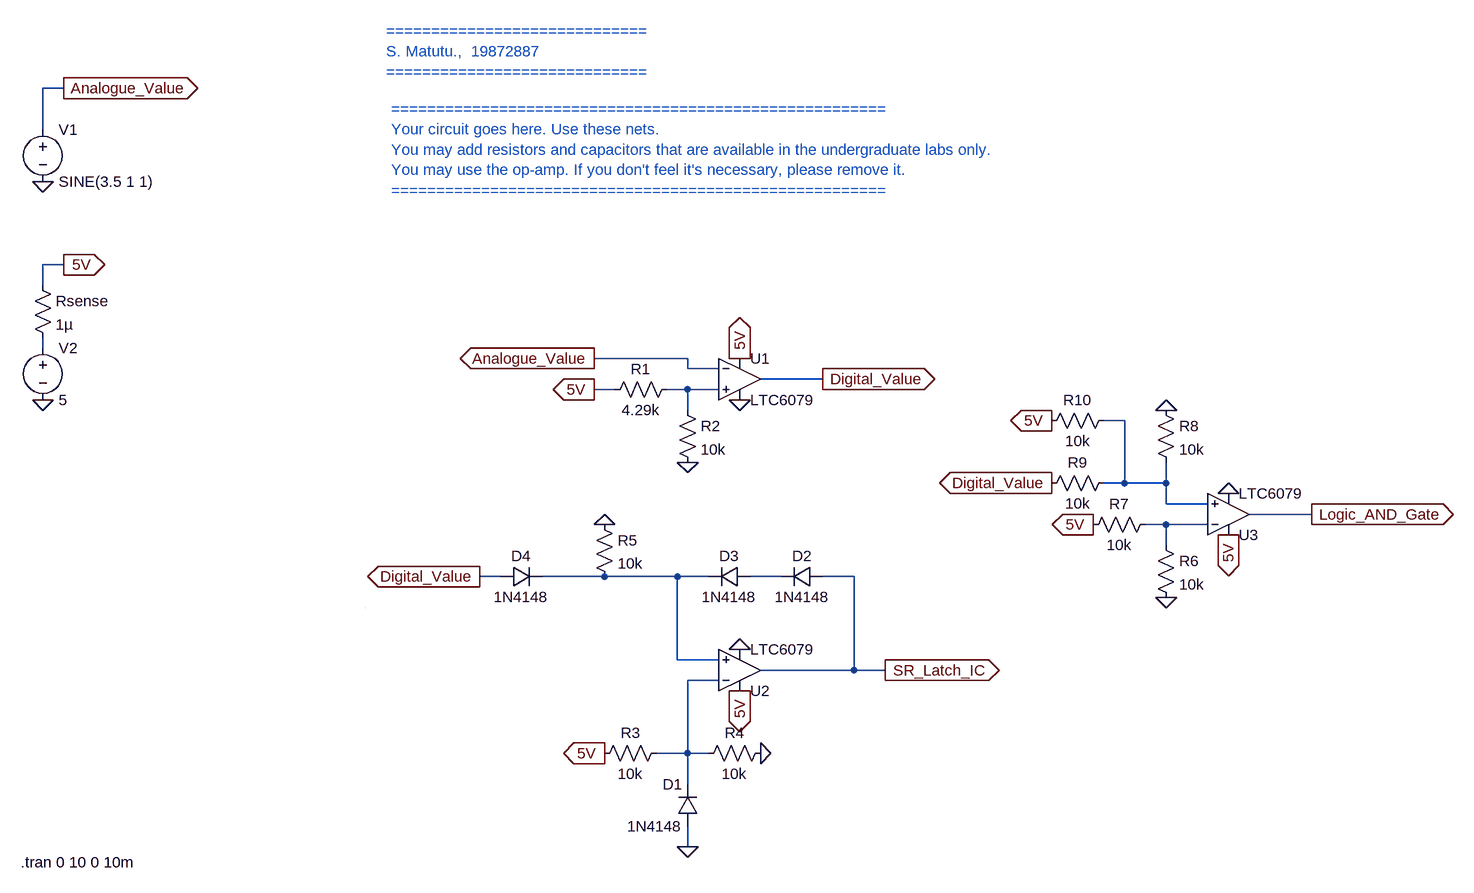
[diagram p0: schematic E344_19872887_A7.asc]
E344_19872887_A7.asc, the LTspice schematic file:
Version 4
SHEET 1 1824 680
WIRE -2048 -1312 -2080 -1312
WIRE -2080 -1248 -2080 -1312
WIRE -2048 -1040 -2080 -1040
WIRE -2080 -1008 -2080 -1040
WIRE -2080 -912 -2080 -928
WIRE -1088 -896 -1232 -896
WIRE -1088 -880 -1088 -896
WIRE -1040 -880 -1088 -880
WIRE -880 -864 -976 -864
WIRE -1200 -848 -1232 -848
WIRE -1088 -848 -1120 -848
WIRE -1040 -848 -1088 -848
WIRE -1088 -816 -1088 -848
WIRE -416 -800 -448 -800
WIRE -416 -704 -416 -800
WIRE -416 -704 -448 -704
WIRE -352 -704 -352 -736
WIRE -352 -704 -416 -704
WIRE -352 -672 -352 -704
WIRE -288 -672 -352 -672
WIRE -128 -656 -224 -656
WIRE -352 -640 -384 -640
WIRE -288 -640 -352 -640
WIRE -352 -608 -352 -640
WIRE -1376 -560 -1408 -560
WIRE -1216 -560 -1312 -560
WIRE -1104 -560 -1216 -560
WIRE -1056 -560 -1104 -560
WIRE -944 -560 -992 -560
WIRE -832 -560 -880 -560
WIRE -1104 -432 -1104 -560
WIRE -1040 -432 -1104 -432
WIRE -832 -416 -832 -560
WIRE -832 -416 -976 -416
WIRE -784 -416 -832 -416
WIRE -1040 -400 -1088 -400
WIRE -1088 -288 -1088 -400
WIRE -1088 -288 -1136 -288
WIRE -1056 -288 -1088 -288
WIRE -1088 -240 -1088 -288
WIRE -1088 -144 -1088 -176
FLAG -256 -624 5V
IOPIN -256 -624 Out
FLAG -1008 -832 0
FLAG -1008 -896 5V
IOPIN -1008 -896 Out
FLAG -1088 -736 0
FLAG -1232 -848 5V
IOPIN -1232 -848 Out
FLAG -1232 -896 Analogue_Value
IOPIN -1232 -896 Out
FLAG -880 -864 Digital_Value
IOPIN -880 -864 Out
FLAG -1008 -448 0
FLAG -1008 -384 5V
IOPIN -1008 -384 Out
FLAG -976 -288 0
FLAG -1088 -144 0
FLAG -1216 -288 5V
IOPIN -1216 -288 Out
FLAG -1216 -640 0
FLAG -1408 -560 Digital_Value
IOPIN -1408 -560 Out
FLAG -256 -688 0
FLAG -352 -528 0
FLAG -464 -640 5V
IOPIN -464 -640 Out
FLAG -352 -816 0
FLAG -528 -800 5V
IOPIN -528 -800 Out
FLAG -528 -704 Digital_Value
IOPIN -528 -704 Out
FLAG -2080 -1168 0
FLAG -2048 -1312 Analogue_Value
IOPIN -2048 -1312 Out
FLAG -2080 -832 0
FLAG -2048 -1040 5V
IOPIN -2048 -1040 Out
FLAG -784 -416 SR_Latch_IC
IOPIN -784 -416 Out
FLAG -128 -656 Logic_AND_Gate
IOPIN -128 -656 Out
SYMBOL OpAmps\\LTC6079 -1008 -864 R0
SYMATTR InstName U1
SYMBOL res -1104 -864 R90
WINDOW 0 0 56 VBottom 2
WINDOW 3 32 56 VTop 2
SYMATTR InstName R1
SYMATTR Value 4.29k
SYMBOL res -1104 -832 R0
SYMATTR InstName R2
SYMATTR Value 10k
SYMBOL OpAmps\\LTC6079 -1008 -416 M180
SYMATTR InstName U2
SYMBOL diode -1072 -176 R180
WINDOW 0 24 64 Left 2
WINDOW 3 24 0 Left 2
SYMATTR InstName D1
SYMATTR Value 1N4148
SYMBOL res -1120 -304 R90
WINDOW 0 0 56 VBottom 2
WINDOW 3 32 56 VTop 2
SYMATTR InstName R3
SYMATTR Value 10k
SYMBOL res -960 -304 R90
WINDOW 0 0 56 VBottom 2
WINDOW 3 32 56 VTop 2
SYMATTR InstName R4
SYMATTR Value 10k
SYMBOL diode -880 -576 R90
WINDOW 0 0 32 VBottom 2
WINDOW 3 32 32 VTop 2
SYMATTR InstName D2
SYMATTR Value 1N4148
SYMBOL diode -992 -576 R90
WINDOW 0 0 32 VBottom 2
WINDOW 3 32 32 VTop 2
SYMATTR InstName D3
SYMATTR Value 1N4148
SYMBOL res -1232 -656 R0
SYMATTR InstName R5
SYMATTR Value 10k
SYMBOL diode -1376 -544 R270
WINDOW 0 32 32 VTop 2
WINDOW 3 0 32 VBottom 2
SYMATTR InstName D4
SYMATTR Value 1N4148
SYMBOL res -368 -624 R0
SYMATTR InstName R6
SYMATTR Value 10k
SYMBOL OpAmps\\LTC6079 -256 -656 M180
SYMATTR InstName U3
SYMBOL res -368 -656 R90
WINDOW 0 0 56 VBottom 2
WINDOW 3 32 56 VTop 2
SYMATTR InstName R7
SYMATTR Value 10k
SYMBOL res -368 -832 R0
SYMATTR InstName R8
SYMATTR Value 10k
SYMBOL res -432 -720 R90
WINDOW 0 0 56 VBottom 2
WINDOW 3 32 56 VTop 2
SYMATTR InstName R9
SYMATTR Value 10k
SYMBOL res -432 -816 R90
WINDOW 0 0 56 VBottom 2
WINDOW 3 32 56 VTop 2
SYMATTR InstName R10
SYMATTR Value 10k
SYMBOL voltage -2080 -1264 R0
WINDOW 123 0 0 Left 0
WINDOW 39 0 0 Left 0
SYMATTR InstName V1
SYMATTR Value SINE(3.5 1 1)
SYMBOL voltage -2080 -928 R0
SYMATTR InstName V2
SYMATTR Value 5
SYMBOL res -2096 -1024 R0
SYMATTR InstName Rsense
SYMATTR Value 1µ
TEXT -1552 -1400 Left 2 ;=============================\nS. Matutu.,  19872887\n=============================
TEXT -1544 -1280 Left 2 ;=======================================================\nYour circuit goes here. Use these nets.\nYou may add resistors and capacitors that are available in the undergraduate labs only.\nYou may use the op-amp. If you don't feel it's necessary, please remove it.\n=======================================================
TEXT -2114 -120 Left 2 !.tran 0 10 0 10m
LINE Normal -1584 -512 -1584 -512 2

The netlist it stands for:
* E344_19872887_A7.asc
XU1 N002 Analogue_Value 5V 0 Digital_Value LTC6078  ; LTC6079, pins In+ In- V+ V- OUT
R1 N002 5V 4.29k
R2 N002 0 10k
XU2 N005 N007 5V 0 SR_Latch_IC LTC6078  ; LTC6079, pins In+ In- V+ V- OUT
D1 0 N007 1N4148
R3 N007 5V 10k
R4 0 N007 10k
D2 SR_Latch_IC N006 1N4148
D3 N006 N005 1N4148
R5 0 N005 10k
D4 Digital_Value N005 1N4148
R6 N004 0 10k
XU3 N003 N004 5V 0 Logic_AND_Gate LTC6078  ; LTC6079, pins In+ In- V+ V- OUT
R7 N004 5V 10k
R8 0 N003 10k
R9 N003 Digital_Value 10k
R10 N003 5V 10k
V1 Analogue_Value 0 SINE(3.5 1 1)
V2 N001 0 5
Rsense 5V N001 1µ
.model D D
.lib standard.dio
* =============================
* S. Matutu.,  19872887
* =============================
* =======================================================
* Your circuit goes here. Use these nets.
* You may add resistors and capacitors that are available in the undergraduate labs only.
* You may use the op-amp. If you don't feel it's necessary, please remove it.
* =======================================================
.tran 0 10 0 10m
.lib LTC5.lib
.backanno
.end